# Altium schematic sheet Open Lamborghino.SchDoc: Open Lamborghino
size 270 x 207 mm; Date: 26-07-2017 11:24:59; SheetNumber: 1
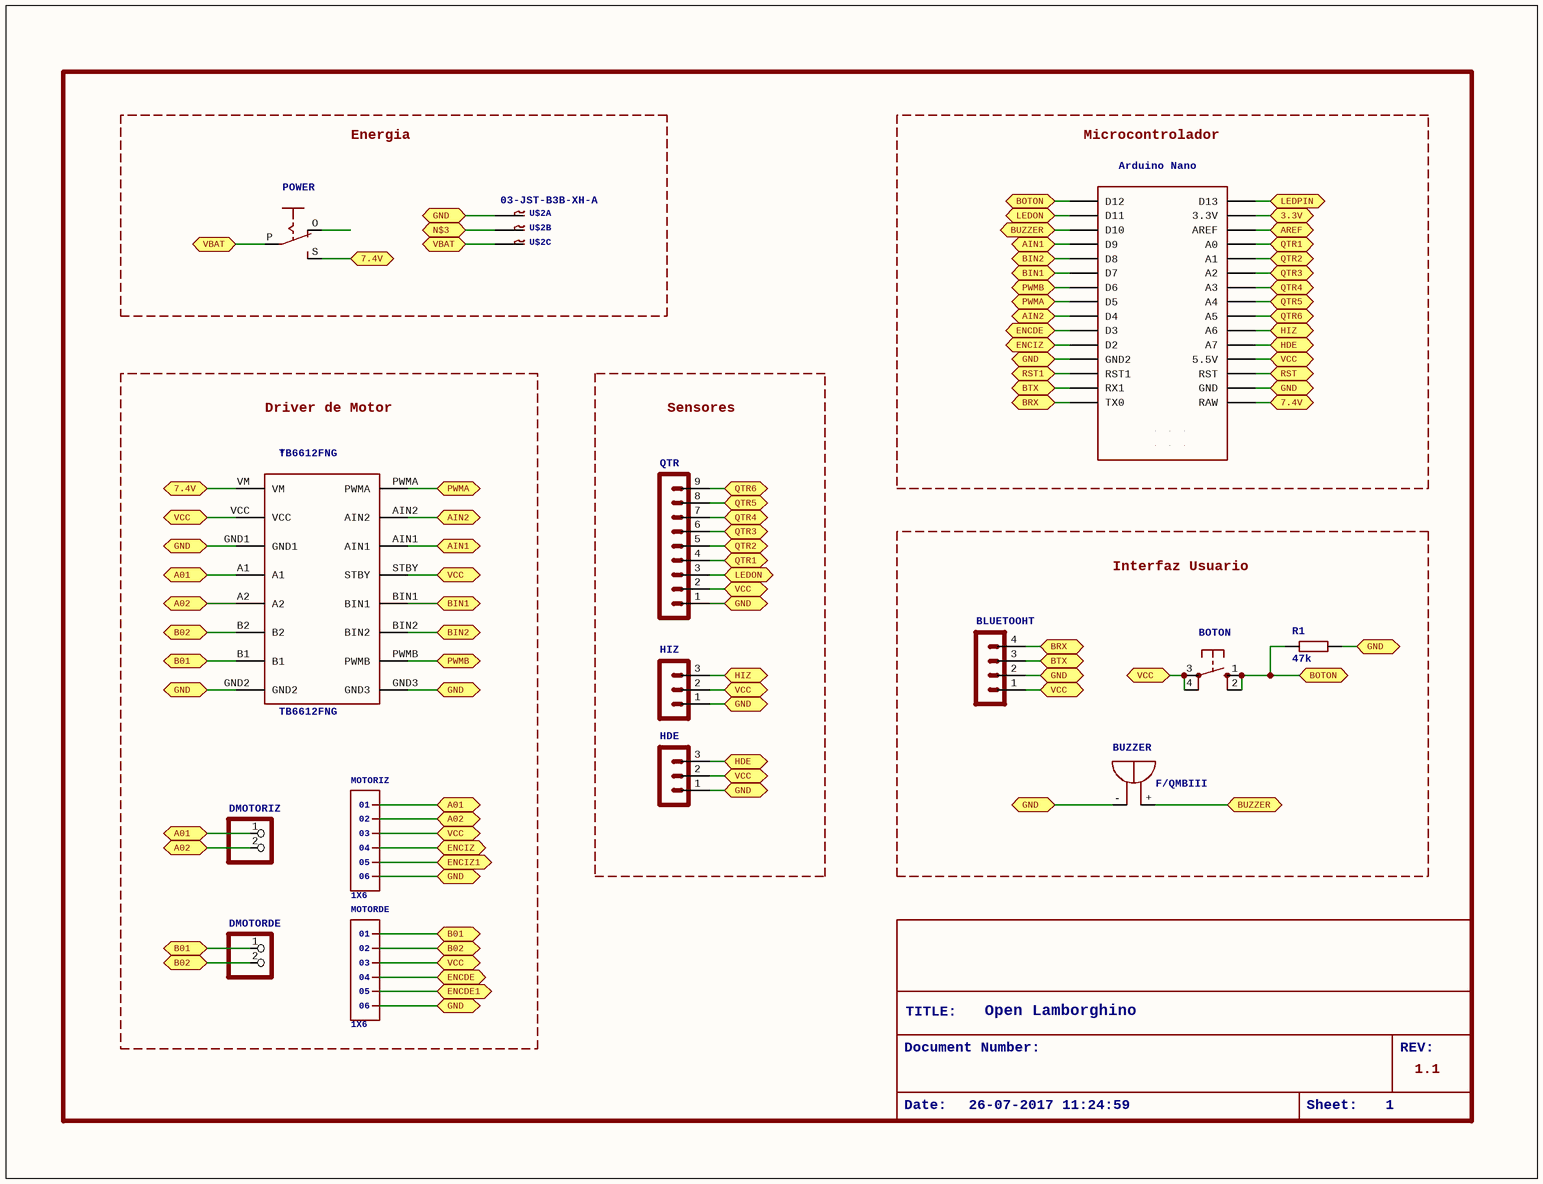
[diagram p0: Open Lamborghino.SchDoc]

## Parts
BLUETOOHT  MA04-1  [MA04-1]  (value not drawn)
BOTON  10-XX  [B3F-10XX]  (value not drawn)
BUZZER  F/QMBIII  [F/QMBIII]
DMOTORDE  PINHD-1X2  [1X02]  (value not drawn)
DMOTORIZ  PINHD-1X2  [1X02]  (value not drawn)
HDE  MA03-1  [MA03-1]  (value not drawn)
HIZ  MA03-1  [MA03-1]  (value not drawn)
MOTORDE  1X6  [1X6]
MOTORIZ  1X6  [1X6]
POWER  EG1218S  [EG1218]  (value not drawn)
QTR  MA09-1  [MA09-1]  (value not drawn)
R1  47k  [R1206]
TB6612FNG  TB6612FNG  [TB6612FNG]
U$1  NANO  [NANO]  (value not drawn)
U$2  03-JST-B3B-XH-A  [B3B-XH]  (parts A,B,C of 3)

## Blocks framed on the sheet
Energia: POWER U$2
Microcontrolador: U$1
Driver de Motor: DMOTORDE DMOTORIZ MOTORDE MOTORIZ TB6612FNG
Sensores: HDE HIZ QTR
Interfaz Usuario: BLUETOOHT BOTON BUZZER R1

## Ports
3.3V, 7.4V, A01, A02, AIN1, AIN2, AREF, B01, B02, BIN1, BIN2, BOTON, BRX, BTX, BUZZER, ENCDE, ENCDE1, ENCIZ, ENCIZ1, GND, HDE, HIZ, LEDON, LEDPIN, N$3, PWMA, PWMB, QTR1, QTR2, QTR3, QTR4, QTR5, QTR6, RST, RST1, VBAT, VCC

## Nets
3.3V: U$1.3.3V ; port 3.3V
7.4V: POWER.S TB6612FNG.VM U$1.RAW ; port 7.4V
A01: DMOTORIZ.1 MOTORIZ.1 TB6612FNG.A1 ; port A01
A02: DMOTORIZ.2 MOTORIZ.2 TB6612FNG.A2 ; port A02
AIN1: TB6612FNG.AIN1 U$1.D9 ; port AIN1
AIN2: TB6612FNG.AIN2 U$1.D4 ; port AIN2
AREF: U$1.AREF ; port AREF
B01: DMOTORDE.1 MOTORDE.1 TB6612FNG.B1 ; port B01
B02: DMOTORDE.2 MOTORDE.2 TB6612FNG.B2 ; port B02
BIN1: TB6612FNG.BIN1 U$1.D7 ; port BIN1
BIN2: TB6612FNG.BIN2 U$1.D8 ; port BIN2
BOTON: BOTON.1(S) BOTON.2(S1) R1.1 U$1.D12 ; port BOTON
BRX: BLUETOOHT.4 U$1.TX0 ; port BRX
BTX: BLUETOOHT.3 U$1.RX1 ; port BTX
BUZZER: BUZZER.+(-) U$1.D10 ; port BUZZER
ENCDE: MOTORDE.4 U$1.D3 ; port ENCDE
ENCDE1: MOTORDE.5 ; port ENCDE1
ENCIZ: MOTORIZ.4 U$1.D2 ; port ENCIZ
ENCIZ1: MOTORIZ.5 ; port ENCIZ1
GND: BLUETOOHT.2 BUZZER.-(+) HDE.1 HIZ.1 MOTORDE.6 MOTORIZ.6 QTR.1 R1.2 TB6612FNG.GND1 TB6612FNG.GND2 TB6612FNG.GND3 U$1.GND U$1.GND1(GND2) U$2.P$1 ; port GND
HDE: HDE.3 U$1.A7 ; port HDE
HIZ: HIZ.3 U$1.A6 ; port HIZ
LEDON: QTR.3 U$1.D11 ; port LEDON
LEDPIN: U$1.D13 ; port LEDPIN
N$3: U$2.P$2 ; port N$3
PWMA: TB6612FNG.PWMA U$1.D5 ; port PWMA
PWMB: TB6612FNG.PWMB U$1.D6 ; port PWMB
QTR1: QTR.4 U$1.A0 ; port QTR1
QTR2: QTR.5 U$1.A1 ; port QTR2
QTR3: QTR.6 U$1.A2 ; port QTR3
QTR4: QTR.7 U$1.A3 ; port QTR4
QTR5: QTR.8 U$1.A4 ; port QTR5
QTR6: QTR.9 U$1.A5 ; port QTR6
RST: U$1.RST ; port RST
RST1: U$1.RST1 ; port RST1
VBAT: POWER.P U$2.P$3 ; port VBAT
VCC: BLUETOOHT.1 BOTON.3(P) BOTON.4(P1) HDE.2 HIZ.2 MOTORDE.3 MOTORIZ.3 QTR.2 TB6612FNG.STBY TB6612FNG.VCC U$1.5V(5.5V) ; port VCC

Not connected (* = marked no-connect by the designer): POWER O; U$1 ICSP1 ICSP2 ICSP3 ICSP4 ICSP5 ICSP6

## Notes on the sheet
- Document Number:
- TITLE:
- Open Lamborghino
- REV:
- Date:
- 26-07-2017 11:24:59
- Sheet:
- 1
- 1.1

## Library data of the parts
BLUETOOHT = MA04-1: PIN HEADER; MF: *; MPN: *; OC_FARNELL: unknown; OC_NEWARK: unknown
BOTON = 10-XX: OMRON SWITCH; MPN: B3F-1000; MF: *; OC_FARNELL: 176432; OC_NEWARK: 36M3542
BUZZER = F/QMBIII: BUZZER    Source: Buerklin; MF: *; MPN: *; OC_FARNELL: unknown; OC_NEWARK: unknown
DMOTORDE DMOTORIZ = PINHD-1X2: PIN HEADER
HDE HIZ = MA03-1: PIN HEADER; MF: *; MPN: *; OC_FARNELL: unknown; OC_NEWARK: unknown
POWER = EG1218S: SLIDING SWITCH   0.1" spacing through hole, vertical SPDT slide switch    http://www.ladyada.net/library/pcb/eaglelibrary.html
QTR = MA09-1: PIN HEADER; MF: *; MPN: *; OC_FARNELL: unknown; OC_NEWARK: unknown
R1 = R-EU_R1206: RESISTOR, European symbol
U$1 = NANO: Arduino Nano; ArduinoNano: Arduino Nano
U$2 = 03-JST-B3B-XH-A: JST CONNECTOR
MOTORDE MOTORIZ = 1X6: 01: 01; 02: 02; 03: 03; 04: 04; 05: 05; 06: 06
TB6612FNG = TB6612FNG: NAME: *